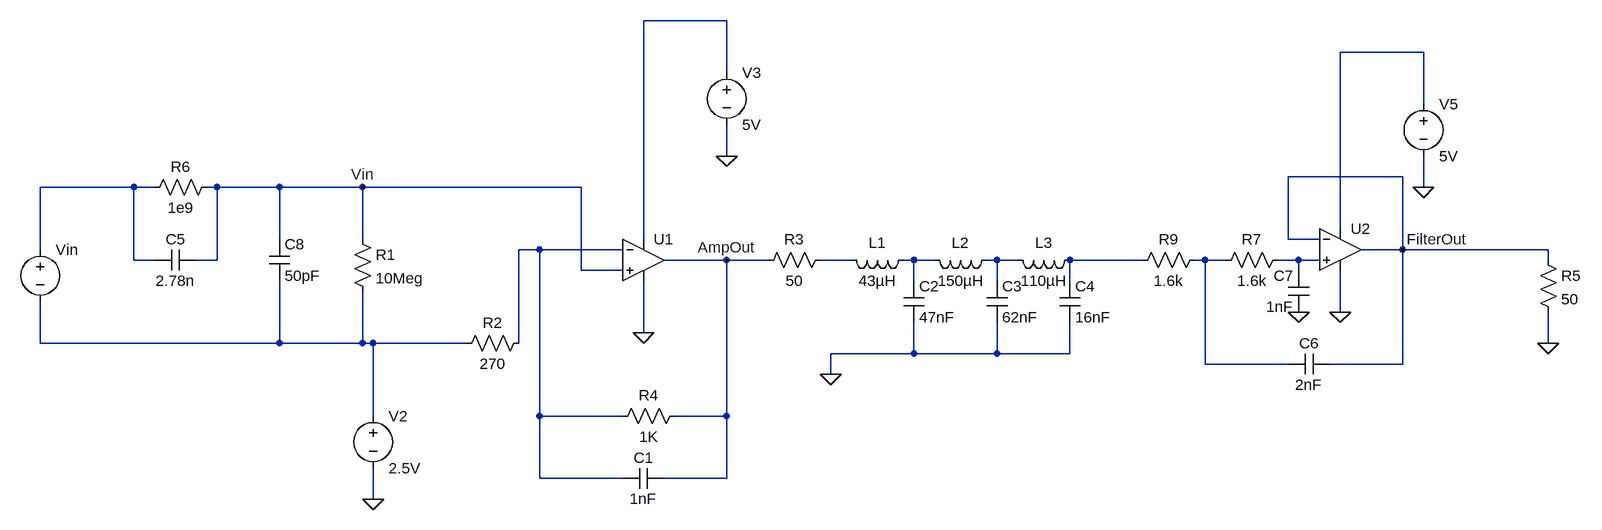
[diagram p0: schematic ltspice_model.asc]
ltspice_model.asc, the LTspice schematic file:
Version 4.1
SHEET 1 2360 736
WIRE 864 -208 736 -208
WIRE 1936 -160 1808 -160
WIRE 864 -128 864 -208
WIRE 1936 -80 1936 -160
WIRE 864 0 864 -48
WIRE 1904 32 1728 32
WIRE -48 48 -192 48
WIRE -16 48 -48 48
WIRE 80 48 64 48
WIRE 176 48 80 48
WIRE 304 48 176 48
WIRE 640 48 304 48
WIRE 1936 48 1936 0
WIRE 1808 112 1808 -160
WIRE 176 128 176 48
WIRE 304 128 304 48
WIRE 736 128 736 -208
WIRE 1728 128 1728 32
WIRE 1776 128 1728 128
WIRE -192 144 -192 48
WIRE 576 144 544 144
WIRE 704 144 576 144
WIRE 1904 144 1904 32
WIRE 1904 144 1840 144
WIRE 2128 144 1904 144
WIRE -48 160 -48 48
WIRE -16 160 -48 160
WIRE 80 160 80 48
WIRE 80 160 48 160
WIRE 864 160 768 160
WIRE 928 160 864 160
WIRE 1056 160 1008 160
WIRE 1152 160 1136 160
WIRE 1184 160 1152 160
WIRE 1280 160 1264 160
WIRE 1312 160 1280 160
WIRE 1504 160 1392 160
WIRE 1600 160 1584 160
WIRE 1632 160 1600 160
WIRE 1744 160 1712 160
WIRE 1776 160 1744 160
WIRE 2128 160 2128 144
WIRE 640 176 640 48
WIRE 704 176 640 176
WIRE 1744 176 1744 160
WIRE 1152 192 1152 160
WIRE 1280 192 1280 160
WIRE 1392 192 1392 160
WIRE 1808 240 1808 176
WIRE 736 272 736 192
WIRE -192 288 -192 224
WIRE 176 288 176 192
WIRE 176 288 -192 288
WIRE 304 288 304 208
WIRE 304 288 176 288
WIRE 320 288 304 288
WIRE 464 288 320 288
WIRE 544 288 544 144
WIRE 2128 288 2128 240
WIRE 1152 304 1152 256
WIRE 1152 304 1024 304
WIRE 1280 304 1280 256
WIRE 1280 304 1152 304
WIRE 1392 304 1392 256
WIRE 1392 304 1280 304
WIRE 1600 320 1600 160
WIRE 1728 320 1600 320
WIRE 1904 320 1904 144
WIRE 1904 320 1792 320
WIRE 1024 336 1024 304
WIRE 320 400 320 288
WIRE 576 400 576 144
WIRE 704 400 576 400
WIRE 864 400 864 160
WIRE 864 400 784 400
WIRE 576 496 576 400
WIRE 704 496 576 496
WIRE 864 496 864 400
WIRE 864 496 768 496
WIRE 320 528 320 480
FLAG 320 528 0
FLAG 864 0 0
FLAG 736 272 0
FLAG 864 160 AmpOut
FLAG 304 48 Vin
FLAG 1024 336 0
FLAG 1936 48 0
FLAG 1808 240 0
FLAG 1904 144 FilterOut
FLAG 2128 288 0
FLAG 1744 240 0
SYMBOL res 288 112 R0
SYMATTR InstName R1
SYMATTR Value 10Meg
SYMBOL res 560 272 R90
WINDOW 0 0 56 VBottom 2
WINDOW 3 32 56 VTop 2
SYMATTR InstName R2
SYMATTR Value 270
SYMBOL OpAmps\\UniversalOpAmp 736 160 R0
SYMATTR InstName U1
SYMATTR Value2 Avol=5Meg GBW=11Meg Vos=1m
SYMATTR SpiceLine En=5.1n Enk=15 In=0.8f Ink=0 Rin=10T
SYMBOL voltage 320 384 R0
SYMATTR InstName V2
SYMATTR Value 2.5V
SYMBOL voltage 864 -144 R0
SYMATTR InstName V3
SYMATTR Value 5V
SYMBOL res 1024 144 R90
WINDOW 0 0 56 VBottom 2
WINDOW 3 32 56 VTop 2
SYMATTR InstName R3
SYMATTR Value 50
SYMBOL cap 768 480 R90
WINDOW 0 0 32 VBottom 2
WINDOW 3 32 32 VTop 2
SYMATTR InstName C1
SYMATTR Value 1nF
SYMBOL res 800 384 R90
WINDOW 0 0 56 VBottom 2
WINDOW 3 32 56 VTop 2
SYMATTR InstName R4
SYMATTR Value 1K
SYMBOL res 80 32 R90
WINDOW 0 0 56 VBottom 2
WINDOW 3 32 56 VTop 2
SYMATTR InstName R6
SYMATTR Value 1e9
SYMBOL cap 48 144 R90
WINDOW 0 0 32 VBottom 2
WINDOW 3 32 32 VTop 2
SYMATTR InstName C5
SYMATTR Value 2.78n
SYMBOL voltage -192 128 R0
WINDOW 123 24 124 Left 2
WINDOW 39 0 0 Left 0
WINDOW 3 24 44 Left 2
SYMATTR Value ""
SYMATTR InstName Vin
SYMBOL cap 1136 192 R0
SYMATTR InstName C2
SYMATTR Value 47nF
SYMBOL cap 1264 192 R0
SYMATTR InstName C3
SYMATTR Value 62nF
SYMBOL cap 1376 192 R0
SYMATTR InstName C4
SYMATTR Value 16nF
SYMBOL ind 1152 144 R90
WINDOW 0 5 56 VBottom 2
WINDOW 3 32 56 VTop 2
SYMATTR InstName L1
SYMATTR Value 43µH
SYMBOL ind 1280 144 R90
WINDOW 0 5 56 VBottom 2
WINDOW 3 32 56 VTop 2
SYMATTR InstName L2
SYMATTR Value 150µH
SYMBOL ind 1408 144 R90
WINDOW 0 5 56 VBottom 2
WINDOW 3 32 56 VTop 2
SYMATTR InstName L3
SYMATTR Value 110µH
SYMBOL OpAmps\\UniversalOpAmp 1808 144 R0
SYMATTR InstName U2
SYMATTR Value2 Avol=5Meg GBW=11Meg Vos=1m
SYMATTR SpiceLine En=5.1n Enk=15 In=0.8f Ink=0 Rin=10T
SYMBOL voltage 1936 -96 R0
SYMATTR InstName V5
SYMATTR Value 5V
SYMBOL res 2112 144 R0
SYMATTR InstName R5
SYMATTR Value 50
SYMBOL res 1728 144 R90
WINDOW 0 0 56 VBottom 2
WINDOW 3 32 56 VTop 2
SYMATTR InstName R7
SYMATTR Value 1.6k
SYMBOL res 1600 144 R90
WINDOW 0 0 56 VBottom 2
WINDOW 3 32 56 VTop 2
SYMATTR InstName R9
SYMATTR Value 1.6k
SYMBOL cap 1792 304 R90
WINDOW 0 0 32 VBottom 2
WINDOW 3 32 32 VTop 2
SYMATTR InstName C6
SYMATTR Value 2nF
SYMBOL cap 1760 240 R180
WINDOW 0 24 56 Left 2
WINDOW 3 24 8 Left 2
SYMATTR InstName C7
SYMATTR Value 1nF
SYMBOL cap 160 128 R0
SYMATTR InstName C8
SYMATTR Value 50pF

The netlist it stands for:
* ltspice_model.asc
R1 Vin N011 10Meg
R2 N004 N011 270
X§U1 Vin N004 N001 0 AmpOut level1 Avol=5Meg GBW=11Meg Vos=1m En=5.1n Enk=15 In=0.8f Ink=0 Rin=10T  ; pins In+ In- V+ V- OUT
V2 N011 0 2.5V
V3 N001 0 5V
R3 N005 AmpOut 50
C1 AmpOut N004 1nF
R4 AmpOut N004 1K
R6 Vin N003 1e9
C5 Vin N003 2.78n
Vin N003 N011
C2 N006 0 47nF
C3 N007 0 62nF
C4 N008 0 16nF
L1 N006 N005 43µH
L2 N007 N006 150µH
L3 N008 N007 110µH
X§U2 N010 FilterOut N002 0 FilterOut level1 Avol=5Meg GBW=11Meg Vos=1m En=5.1n Enk=15 In=0.8f Ink=0 Rin=10T  ; pins In+ In- V+ V- OUT
V5 N002 0 5V
R5 FilterOut 0 50
R7 N010 N009 1.6k
R9 N009 N008 1.6k
C6 FilterOut N009 2nF
C7 0 N010 1nF
C8 Vin N011 50pF
.lib UniversalOpAmp1.lib
.backanno
.end